# Altium schematic sheet Distribution_amp_10Mhz.SchDoc
size A2
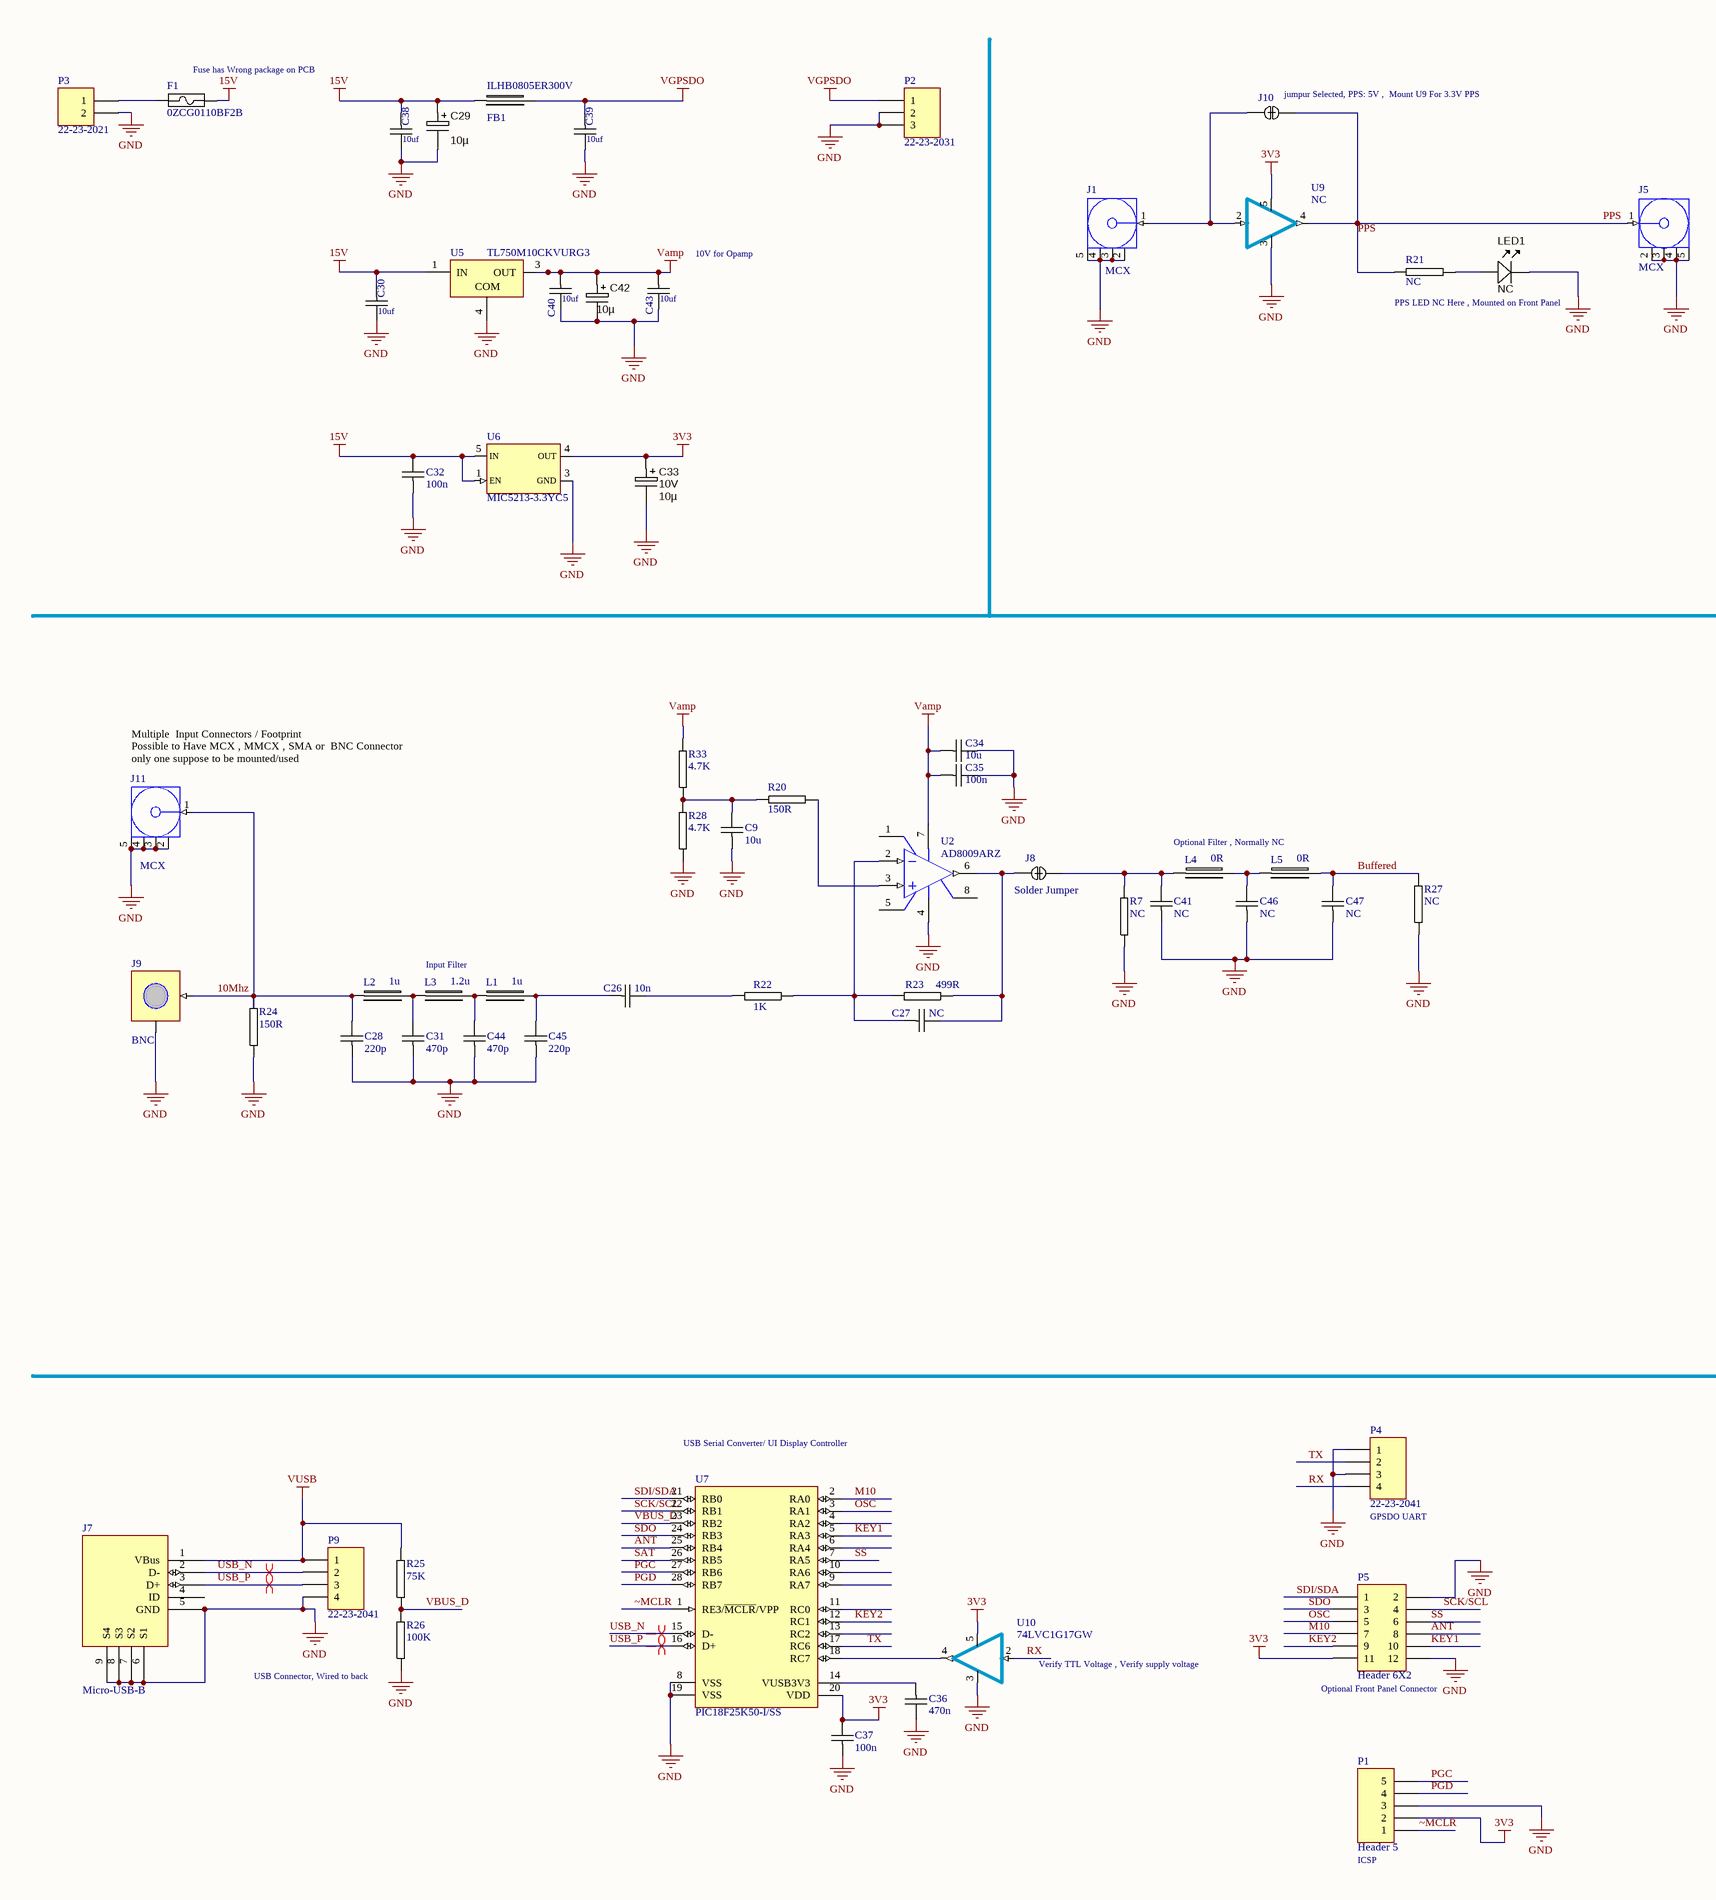
[diagram p0: Distribution_amp_10Mhz.SchDoc, left]
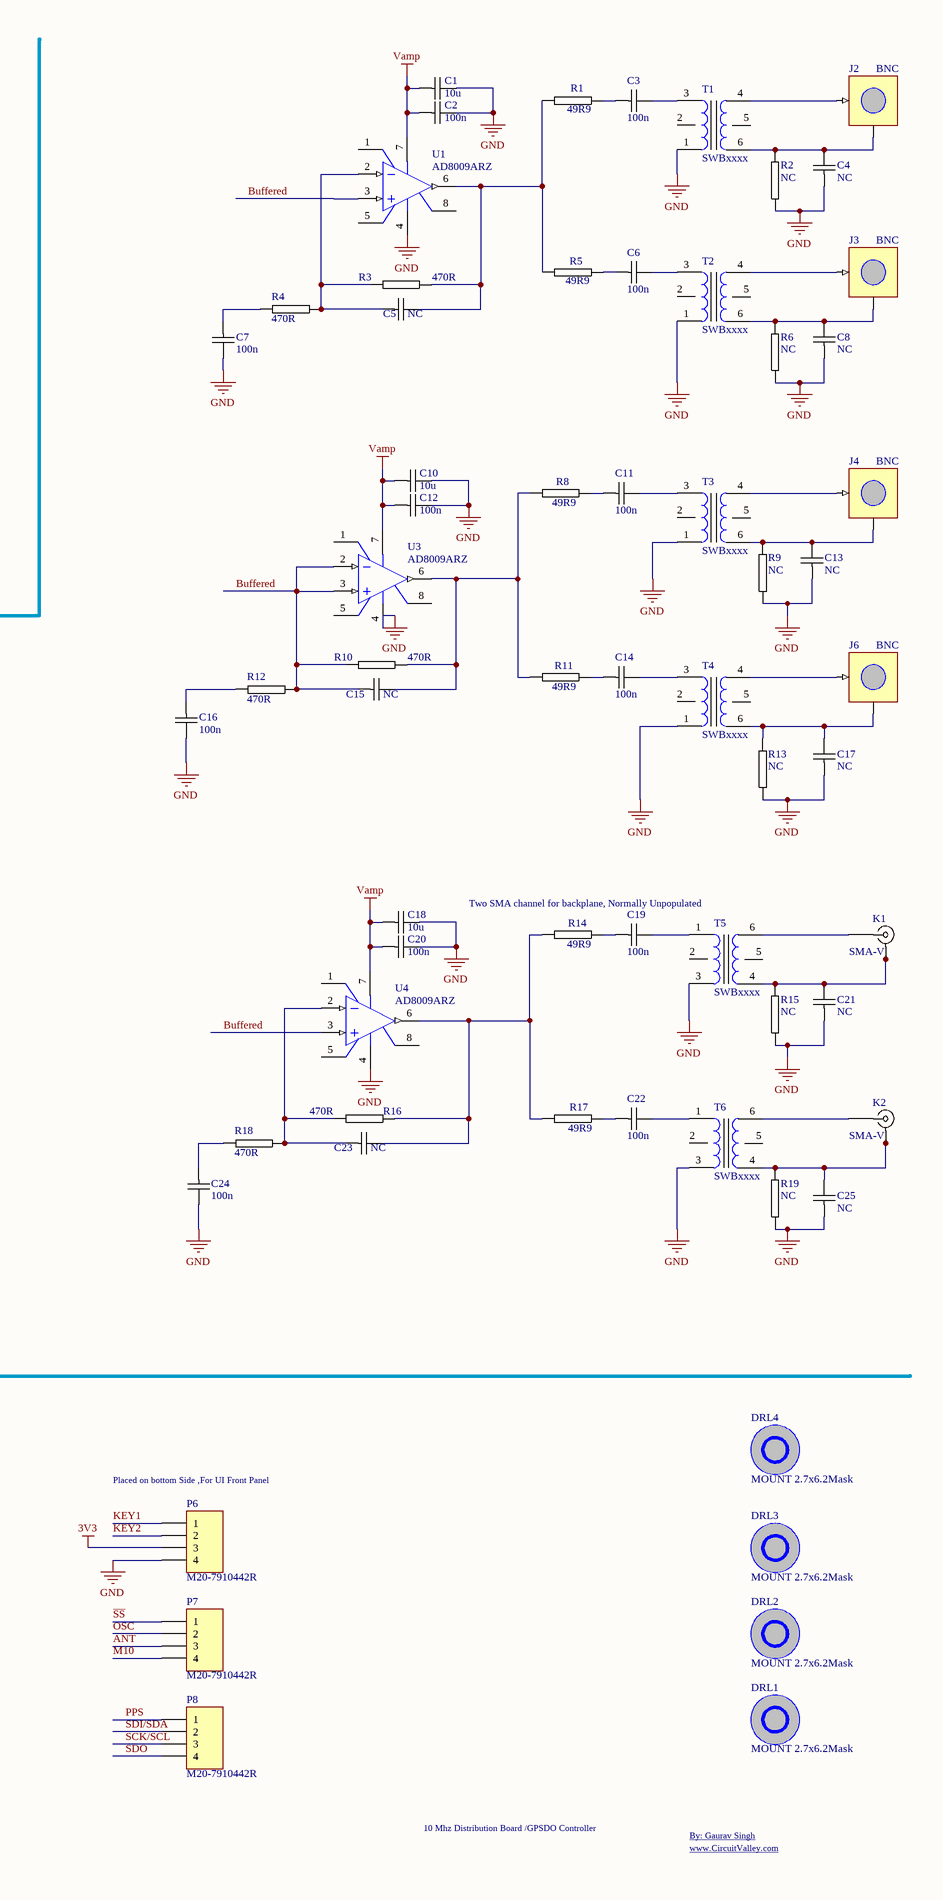
[diagram p1: Distribution_amp_10Mhz.SchDoc, right]

## Parts
C1  10u  [0805C-TBD]
C2  100n  [0805C-TBD]
C3  100n  [0805C-TBD]
C4  NC  [0805C-TBD]
C5  NC  [0805C-TBD]
C6  100n  [0805C-TBD]
C7  100n  [0805C-TBD]
C8  NC  [0805C-TBD]
C9  10u  [0805C-TBD]
C10  10u  [0805C-TBD]
C11  100n  [0805C-TBD]
C12  100n  [0805C-TBD]
C13  NC  [0805C-TBD]
C14  100n  [0805C-TBD]
C15  NC  [0805C-TBD]
C16  100n  [0805C-TBD]
C17  NC  [0805C-TBD]
C18  10u  [0805C-TBD]
C19  100n  [0805C-TBD]
C20  100n  [0805C-TBD]
C21  NC  [0805C-TBD]
C22  100n  [0805C-TBD]
C23  NC  [0805C-TBD]
C24  100n  [0805C-TBD]
C25  NC  [0805C-TBD]
C26  10n  [0805C-TBD]
C27  NC  [0805C-TBD]
C28  220p  [0805C-TBD]
C29  10µ  [CAPMP3528X210N]
C30  10uf  [1210C-GENERIC]
C31  470p  [0805C-TBD]
C32  100n  [0603C-GENERIC]
C33  Ratings: 10V  [CAPMP3528X210N]  (hidden comment: 10µ)
C34  10u  [0805C-TBD]
C35  100n  [0805C-TBD]
C36  470n  [0805C-TBD]
C37  100n  [0805C-TBD]
C38  10uf  [1210C-GENERIC]
C39  10uf  [1210C-GENERIC]
C40  10uf  [1210C-GENERIC]
C41  NC  [0805C-TBD]
C42  10µ  [CAPMP3528X210N]
C43  10uf  [1210C-GENERIC]
C44  470p  [0805C-TBD]
C45  220p  [0805C-TBD]
C46  NC  [0805C-TBD]
C47  NC  [0805C-TBD]
DRL1  MOUNT 2.7x6.2Mask  [NO_COPPER_NOMASK_2m75_6m2]
DRL2  MOUNT 2.7x6.2Mask  [NO_COPPER_NOMASK_2m75_6m2]
DRL3  MOUNT 2.7x6.2Mask  [NO_COPPER_NOMASK_2m75_6m2]
DRL4  MOUNT 2.7x6.2Mask  [NO_COPPER_NOMASK_2m75_6m2]
F1  0ZCG0110BF2B  [RESC3216N]
FB1  ILHB0805ER300V  [0805FB-600Z]
J1  MCX  [CON-MCX]
J2  BNC  [BNC 1-1634612-0]
J3  BNC  [BNC 1-1634612-0]
J4  BNC  [BNC 1-1634612-0]
J5  MCX  [CON-REVMCX]
J6  BNC  [BNC 1-1634612-0]
J7  Micro-USB-B  [10118193-0001lfc]
J8  Solder Jumper  [BYPASS-MINI-CLOSED]
J9  BNC  [BNC 1-1634612-0]
J10  Solder Jumper  [BYPASS-CLOSED]  (value not drawn)
J11  MCX  [CON-REVMCX]
K1  SMA-V  [SMA-V]
K2  SMA-V  [SMA-V]
L1  1u  [0805FB-GENERIC]
L2  1u  [0805FB-GENERIC]
L3  1.2u  [0805FB-GENERIC]
L4  0R  [0805FB-GENERIC]
L5  0R  [0805FB-GENERIC]
LED1  NC  [LED-0805-K]
P1  Header 5  [HDR1X5]
P2  22-23-2031  [22-23-2031]
P3  22-23-2021  [22-23-2021]
P4  22-23-2041  [22-23-2041]
P5  Header 6X2  [HDR2X6]
P6  M20-7910442R  [M20-7910442R]
P7  M20-7910442R  [M20-7910442R]
P8  M20-7910442R  [M20-7910442R]
P9  22-23-2041  [22-23-2041]
R1  49R9  [0805R-GENERIC]
R2  NC  [0805R-GENERIC]
R3  470R  [0805R-GENERIC]
R4  470R  [0805R-GENERIC]
R5  49R9  [0805R-GENERIC]
R6  NC  [0805R-GENERIC]
R7  NC  [0805R-GENERIC]
R8  49R9  [0805R-GENERIC]
R9  NC  [0805R-GENERIC]
R10  470R  [0805R-GENERIC]
R11  49R9  [0805R-GENERIC]
R12  470R  [0805R-GENERIC]
R13  NC  [0805R-GENERIC]
R14  49R9  [0805R-GENERIC]
R15  NC  [0805R-GENERIC]
R16  470R  [0805R-GENERIC]
R17  49R9  [0805R-GENERIC]
R18  470R  [0805R-GENERIC]
R19  NC  [0805R-GENERIC]
R20  150R  [0805R-GENERIC]
R21  NC  [0805R-GENERIC]
R22  1K  [0805R-GENERIC]
R23  499R  [0805R-GENERIC]
R24  150R  [0805R-GENERIC]
R25  75K  [0805R-GENERIC]
R26  100K  [0805R-GENERIC]
R27  NC  [0805R-GENERIC]
R28  4.7K  [0805R-GENERIC]
R33  4.7K  [0805R-GENERIC]
T1  SWBxxxx  [SWBxxxx]
T2  SWBxxxx  [SWBxxxx]
T3  SWBxxxx  [SWBxxxx]
T4  SWBxxxx  [SWBxxxx]
T5  SWBxxxx  [SWBxxxx]
T6  SWBxxxx  [SWBxxxx]
U1  AD8009ARZ  [M08A_N]
U2  AD8009ARZ  [M08A_N]
U3  AD8009ARZ  [M08A_N]
U4  AD8009ARZ  [M08A_N]
U5  TL750M10CKVURG3  [TI-KVU3_N]
U6  MIC5213-3.3YC5  [SC70-5]
U7  PIC18F25K50-I/SS  [MCHP-SSOP-SS28_N]
U9  NC  [SC70-5]
U10  74LVC1G17GW  [SC70-5]

## Nets
3V3: C33.1 C37.2 P1.2 P5.11 P6.3 U6.4(OUT) U7.20(VDD) U9.5(VCC) U10.5(VCC)
15V: C29.1 C30.1 C32.2 C38.1 F1.1 FB1.1 U5.1(IN) U6.1(EN) U6.5(IN)
GND: C1.2 C2.2 C4.1 C7.2 C8.1 C9.1 C10.2 C12.2 C13.1 C16.2 C17.1 C18.2 C20.2 C21.1 C24.2 C25.1 C28.1 C29.2 C30.2 C31.1 C32.1 C33.2 C34.2 C35.2 C36.2 C37.1 C38.2 C39.2 C40.2 C41.1 C42.2 C43.2 C44.1 C45.1 C46.1 C47.1 J1.2(GND) J1.3(GND) J1.4(GND) J1.5(GND) J5.2(GND) J5.3(GND) J5.4(GND) J5.5(GND) J7.5(GND) J7.6(S1) J7.7(S2) J7.8(S3) J7.9(S4) J9.2 J11.2(GND) J11.3(GND) J11.4(GND) J11.5(GND) LED1.K P1.3 P2.2 P2.3 P3.2 P4.1 P4.3 P5.2 P5.12 P6.4 P9.4 R2.1 R6.1 R7.1 R9.1 R13.1 R15.1 R19.1 R24.1 R26.1 R27.1 R28.1 T1.1 T2.1 T3.1 T4.1 T5.3 T6.3 U1.4(V-) U2.4(V-) U3.4(V-) U4.4(V-) U5.4(COM) U6.3(GND) U7.8(VSS) U7.19(VSS) U9.3(GND) U10.3(GND)
Vamp: C1.1 C2.1 C10.1 C12.1 C18.1 C20.1 C34.1 C35.1 C40.1 C42.1 C43.1 R33.2 U1.7(V+) U2.7(V+) U3.7(V+) U4.7(V+) U5.3(OUT)
VGPSDO: C39.1 FB1.2 P2.1
VUSB: J7.1(VBus) P9.1 R25.2
10Mhz: C28.2 J9.1 J11.1(Signal) L2.1 R24.2
ANT: P5.8 P7.3 U7.25(RB4)
Buffered: C15.1 C47.2 L5.2 R10.1 R12.2 R27.2 U1.3(IN+) U3.2(IN-) U3.3(IN+) U4.3(IN+)
KEY1: P5.10 P6.1 U7.5(RA3)
KEY2: P5.9 P6.2 U7.12(RC1)
M10: P5.7 P7.4 U7.2(RA0)
OSC: P5.5 P7.2 U7.3(RA1)
PGC: P1.5 U7.27(RB6)
PGD: P1.4 U7.28(RB7)
PPS: J5.1(Signal) J10.1 P8.1 R21.2 U9.4
RX: P4.4 U10.2
~{SS}: P5.6 P7.1 U7.7(RA5)
SAT: U7.26(RB5)
SCK/SCL: P5.4 P8.3 U7.22(RB1)
SDI/SDA: P5.1 P8.2 U7.21(RB0)
SDO: P5.3 P8.4 U7.24(RB3)
TX: P4.2 U7.17(RC6)
USB_N: J7.2(D-) P9.2 U7.15(D-)
USB_P: J7.3(D+) P9.3 U7.16(D+)
VBUS_D: R25.1 R26.2 U7.23(RB2)
~MCLR: P1.1 U7.1(RE3/~{MCLR}/VPP)
NetC3_1: C3.1 R1.2
NetC3_2: C3.2 T1.3
NetC4_2: C4.2 J2.2 R2.2 T1.6
NetC5_1: C5.1 R3.1 R4.2 U1.2(IN-)
NetC5_2: C5.2 R1.1 R3.2 R5.1 U1.6(OUT)
NetC6_1: C6.1 R5.2
NetC6_2: C6.2 T2.3
NetC7_1: C7.1 R4.1
NetC8_2: C8.2 J3.2 R6.2 T2.6
NetC9_2: C9.2 R20.2 R28.2 R33.1
NetC11_1: C11.1 R8.2
NetC11_2: C11.2 T3.3
NetC13_2: C13.2 J4.2 R9.2 T3.6
NetC14_1: C14.1 R11.2
NetC14_2: C14.2 T4.3
NetC15_2: C15.2 R8.1 R10.2 R11.1 U3.6(OUT)
NetC16_1: C16.1 R12.1
NetC17_2: C17.2 J6.2 R13.2 T4.6
NetC19_1: C19.1 R14.2
NetC19_2: C19.2 T5.1
NetC21_2: C21.2 K1.2 K1.3 K1.4 K1.5 R15.2 T5.4
NetC22_1: C22.1 R17.2
NetC22_2: C22.2 T6.1
NetC23_1: C23.1 R16.1 R18.2 U4.2(IN-)
NetC23_2: C23.2 R14.1 R16.2 R17.1 U4.6(OUT)
NetC24_1: C24.1 R18.1
NetC25_2: C25.2 K2.2 K2.3 K2.4 K2.5 R19.2 T6.4
NetC26_1: C26.1 C45.2 L1.2
NetC26_2: C26.2 R22.1
NetC27_1: C27.1 R22.2 R23.1 U2.2(IN-)
NetC27_2: C27.2 J8.1 R23.2 U2.6(OUT)
NetC31_2: C31.2 L2.2 L3.1
NetC36_1: C36.1 U7.14(VUSB3V3)
NetC41_2: C41.2 J8.2 L4.1 R7.2
NetC44_2: C44.2 L1.1 L3.2
NetC46_2: C46.2 L4.2 L5.1
NetF1_2: F1.2 P3.1
NetJ1_1: J1.1(Signal) J10.2 U9.2
NetJ2_1: J2.1 T1.4
NetJ3_1: J3.1 T2.4
NetJ4_1: J4.1 T3.4
NetJ6_1: J6.1 T4.4
NetK1_1: K1.1 T5.6
NetK2_1: K2.1 T6.6
NetLED1_A: LED1.A R21.1
NetR20_1: R20.1 U2.3(IN+)
NetU7_18: U7.18(RC7) U10.4

Not connected (* = marked no-connect by the designer): J7 4(ID); T1 2 5; T2 2 5; T3 2 5; T4 2 5; T5 2 5; T6 2 5; U1 1(NC) 5(NC) 8(NC); U2 1(NC) 5(NC) 8(NC); U3 1(NC) 5(NC) 8(NC); U4 1(NC) 5(NC) 8(NC); U7 4(RA2) 6(RA4) 9(RA7) 10(RA6) 11(RC0) 13(RC2)

## Layout directives
differential pair: USB_N, USB_P

## Notes on the sheet
- Fuse has Wrong package on PCB
- (near J10) jumpur Selected, PPS: 5V ,  Mount U9 For 3.3V PPS
- (near C43) 10V for Opamp
- PPS LED NC Here , Mounted on Front Panel
- Multiple  Input Connectors / Footprint
  Possible to Have MCX , MMCX , SMA or  BNC Connector
  only one suppose to be mounted/used
- Optional Filter , Normally NC
- Two SMA channel for backplane, Normally Unpopulated
- Input Filter
- USB Serial Converter/ UI Display Controller
- (near P4) GPSDO UART
- (near P6) Placed on bottom Side ,For UI Front Panel
- (near R26) USB Connector, Wired to back
- (near U10) Verify TTL Voltage , Verify supply voltage
- (near P5) Optional Front Panel Connector
- 10 Mhz Distribution Board /GPSDO Controller
- (near P1) ICSP
- www.CircuitValley.com
- By: Gaurav Singh
- Title
- Size:
- Date:
- A2
- Number:
- Time:
- Revision:
- Sheet
- of

## Library data of the parts
C1 C10 C18 C34 = 0805C-TBD: Cap Ceramic 0805; Part: GRM21BC81C106KE15L
C2 C12 C20 C37 = 0805C-TBD: Cap Ceramic 0805; Part: GRM21BR71H104KA01K
C3 C6 C7 C11 C14 C16 C19 C22 C24 = 0805C-100nF-25V-X7R-MUR: Cap Ceramic 0805; Part: GRM21BR71H104KA01K
C4 C5 C8 C13 C15 C17 C21 C23 C25-C27 C41 C46 C47 = 0805C-100nF-25V-X7R-MUR: Cap Ceramic 0805
  C4 C5 C8 C13 C15 C17 C21 C25 C27 C41 C46 C47: Supplier 1: Digi-Key; Supplier Part Number 1: 490-1673-1-ND
C9 = 0805C-100nF-25V-X7R-MUR: Cap Ceramic 0805; Part: GRM21BC81C106KE15L
C28 C45 = 0805C-100nF-25V-X7R-MUR: Cap Ceramic 0805; Part: CC0805FRNPO9BN221
C29 C33 C42 = CAPT_47u_1210_6V3: Capacitor SMD Tantalum 47uF 20% 6.3V 1210; Manufacturer 1: AVX Corporation; Manufacturer Part Number 1: TCJB476M006R0070; Manufacturer Size Code: B; Voltage - Rated: 6V3; ESR (Equivalent Series Resistance): 70.0 mOhm; Type: Molded; Package / Case: 1210 (3528 Metric); Tolerance: ±20%; Material: Tantalum; Supplier 1: Digi-Key; Supplier Part Number 1: 478-3139-1-ND; Operating Temperature: -55°C ~ 125°C; Size / Dimension: 0.138" L x 0.110" W (3.50mm x 2.80mm); Height - Seated (Max): 0.083" (2.10mm); ComponentLink1URL: http://www.avx.com/docs/Catalogs/tcj.pdf; ComponentLink1Description: http://www.avx.com/docs/Catalogs/tcj.pdf; Value: 10µ
C30 C38-C40 C43 = 1210C-2u2-35V: Cap Ceramic 1210; Manufacturer: Panasonic - ECG; Manufacturer Part Number: ECJ-4YB0J226M; Part: GRM32DC81E106KA12L; Reel: C25; Supplier 1: Digi-Key; Supplier Part Number 1: 587-2255-2-ND
C31 C44 = 0805C-100nF-25V-X7R-MUR: Cap Ceramic 0805; Part: VJ0805Y471JXAPW1BC
C32 = 0603C-100NF-25V-X7R-TDK: Cap Ceramic 0603; Part: C0603X104K5RAC
C35 = 0805C-TBD: Cap Ceramic 0805
C36 = 0805C-100nF-25V-X7R-MUR: Cap Ceramic 0805; Part: CL21B474KBFNFNE
DRL1-DRL4 = DRILL_2.7x6.2Mask_NOCOPPER
F1 = FUSE-GENERIC: GENERIC FUSE; Part: 0ZCG0110BF2B
FB1 = 0805FB-600Z: FERRITE BEAD 600 OHM 2A; Part: ILHB0805ER300V
J1 = CONMCX001: MCX Female PCB Mount Connector, Thru-Hole; Part: 919-382J-51P
J2-J4 J6 J9 = BNC Connector: Part: 1-1337543-0 / 1-1634612-0
J5 J11 = CONREVMCX001: RP-MCX Female PCB Mount Connector; Part: 919-382J-51P
J8 = BYPASS-MINI-CLOSED: Manufacturer Part Number 1: Board Feature; Reel: Closed; Supplier 1: Solder-it-yourself; Manufacturer 1: Board feature
J10 = BYPASS-CLOSED: Manufacturer Part Number 1: Board Feature; Reel: Closed; Supplier 1: Solder-it-yourself; Manufacturer 1: Board feature
K1 K2 = SMA-V: SMA THREADED RF CONNECTOR VERTICAL; Part: NC
L1 L2 = 0805FB-GENERIC: Inductor; Part: 0805LS-102XGEB
L3 = 0805FB-GENERIC: Inductor; Part: 0805LS-122XGEB
L4 L5 = 0805FB-GENERIC: Inductor; Part: RC0805FR-070RL
LED1 = LED_SMD_Green_0805: LED, 0805 SMD, Green; Manufacturer 1: Ligitek; Manufacturer Part Number 1: LG170G-CT; Material: GaP; Ratings: 10 mcd; 573 nm; Package / Case: 0805
P1 = Header 5: Header, 5-Pin; LatestRevisionDate: 17-Jul-2002; LatestRevisionNote: Re-released for DXP Platform.; Publisher: Altium Limited
P2 = Header 3: Header, 3-Pin; LatestRevisionDate: 17-Jul-2002; LatestRevisionNote: Re-released for DXP Platform.; Publisher: Altium Limited; Part: 22-23-2031
P3 = Header 2: Header, 2-Pin; LatestRevisionDate: 17-Jul-2002; LatestRevisionNote: Re-released for DXP Platform.; Publisher: Altium Limited; Part: 22-23-2021
P4 P9 = Header 4: Header, 4-Pin; LatestRevisionDate: 17-Jul-2002; LatestRevisionNote: Re-released for DXP Platform.; Publisher: Altium Limited
  P4: Part: 22-23-2041
P5 = Header 6X2: Header, 6-Pin, Dual row; LatestRevisionDate: 17-Jul-2002; LatestRevisionNote: Re-released for DXP Platform.; Publisher: Altium Limited
P6-P8 = Header 4: SMD Female Header; Part: M20-7910442R
R1 R5 R8 R11 R14 R17 = 0805R-0R: Resistor 0805; Part: NRC10F49R9TRF
R2 R6 R7 R9 R13 R15 R19 R21 R27 = 0805R-0R: Resistor 0805
R3 R4 R10 R12 R16 R18 = 0805R-0R: Resistor 0805; Part: RR1220P-471-D
R20 R24 = 0805R-0R: Resistor 0805; Part: RK73H2ATTDD1500F
R22 = 0805R-0R: Resistor 0805; Part: RC0805FR-131KL
R23 = 0805R-0R: Resistor 0805; Part: RC0805FR-07499RL
R25 = 0805R-0R: Resistor 0805; Part: RR1220P-753-D
R26 = 0805R-0R: Resistor 0805; Part: CRCW0805100KFKEA
R28 R33 = 0805R-0R: Resistor 0805; Part: ERA6AEB472V
T1-T6 = Transformer SWBxxxx: RF Transformer; Part: SWB1010
U1-U4 = LM7171AIM: Very High Speed, High Output Current, Voltage Feedback Amplifier, 8-pin Narrow SOIC; CompType: Amplifiers; PinCount: 8; Part: AD8009ARZ
U5 = TL750M10CKVURG3: Single Output LDO, 750 mA, Fixed 10 V Output, 11 to 26 V; Manufacturer: Texas Instruments; Accuracy(%): 2; Eco-Plan: Green (RoHS & no Sb/Br); Fixed Output Options(V): 10; Iout(Max)(A): 0.75; Iq(Typ)(mA): 60; Rating: Catalog; SubFamily: Single Channel LDO; Vdo(Typ)(mV): 600; Vin(Max)(V): 26; Vin(Min)(V): 11; DatasheetVersion: SLVS021N; PackageVersion: 4205521-2/D; PackageReference: KVU3; PackageDescription: 3-Pin Plastic Flange Mount, Body 6.1 x 6.6 mm, Pitch 2.29 mm; Supplier 1: Digi-Key; Supplier Part Number 1: 296-21599-2-ND; Supplier 2: Digi-Key; Supplier Part Number 2: 296-21599-1-ND; Supplier 3: Digi-Key; Supplier Part Number 3: 296-21599-6-ND; Supplier 4: Newark; Supplier Part Number 4: 99K4385; Supplier 5: Mouser; Supplier Part Number 5: 595-TL750M10CKVURG3; Vout Adj(Max)(V): 10; Vout Adj(Min)(V): 10; Mounting Technology: Surface Mount; Code_JEDEC: TO-252; PartNumber: TL750M10CKVURG3; ComponentLink1Description: Manufacturer URL; ComponentLink1URL: http://www.ti.com/; ComponentLink2Description: Datasheet; ComponentLink2URL: http://www.ti.com/general/docs/lit/getliterature.tsp?genericPartNumber=TL750M10&fileType=pdf; ComponentLink3Description: Package Specification; ComponentLink3URL: http://www.ti.com/litv/pdf/mpsf018c; ComponentLink4Description: URL Link1; ComponentLink4URL: Samples URL:http://www.ti.com/product/tl750m10#samples; Part: TL750M10CKVURG3
U6 = MIC5213: LDO 3.3V; Part: MIC5213-3.3YC5
U7 = PIC18F25K50-I/SS: Low-Power, High-Performance Microcontroller with XLP Technology, 48 MHz, 24 I/O, -40 to 85 degC, 28-pin SSOP (SS28), Tube; Manufacturer: Microchip; # of A/D Channels: 14; Digital Communication: 1 -A/E/USART, 1 -MSSP(SPI/I2C); EEPROM Data Memory (bytes): 256; I/O Pins: 24; Internal Oscillator: 16 MHz, 31 kHz; Max. CPU Speed MHz: 48; Memory Type: Flash; Operation Voltage Range: 1.8V - 5.5V; Program Memory KBytes: 32; Program Memory KWords: 16; RAM: 2048; Timers: 2 - 8-bit, 2 - 16-bit; DatasheetVersion: Rev. A; PackageVersion: C04-073B, 12/2012; PackageReference: SSOP-SS28; PackageDescription: 28-Lead Plastic Shrink Small Outline, 10.2 x 5.3 mm Body, 0.65 mm Pitch; Supplier 1: Digi-Key; Supplier Part Number 1: PIC18F25K50-I/SS-ND; Supplier 2: Farnell; Supplier Part Number 2: 2305833; Supplier 3: Newark; Supplier Part Number 3: 06W2974; Supplier 4: Mouser; Supplier Part Number 4: 579-PIC18F25K50-I/SS; Packing: TUBE; RoHS: TRUE; Mounting Technology: Surface Mount; PartNumber: PIC18F25K50-I/SS; ComponentLink1Description: Datasheet; ComponentLink1URL: http://ww1.microchip.com/downloads/en/DeviceDoc/30684A.pdf; ComponentLink2Description: Package Specification; ComponentLink2URL: http://www.microchip.com/stellent/groups/techpub_sg/documents/packagingspec/en012702.pdf; ComponentLink3Description: URL Link1; ComponentLink3URL: Product URL:http://www.microchip.com/datasheet/PIC18F25K50; Part: PIC18F25K50-I/SS
U9 U10 = 74LVC1G17GW-Q100: Logic Buffer; Part: 74LVC1G17GW-Q100
J7 = Micro-USB-B: Mouser: https://www.mouser.de/Search/ProductDetail.aspx?R=10118193-0001LFvirtualkey64910000virtualkey649-10118193-0001LF; Part: 10118193-0001lfc